# Altium schematic sheet MCU.SchDoc: =ProjectName
size A4; CheckedBy: DatNB; Author: Ven; CompanyName: Nacentech; Organization: IMET
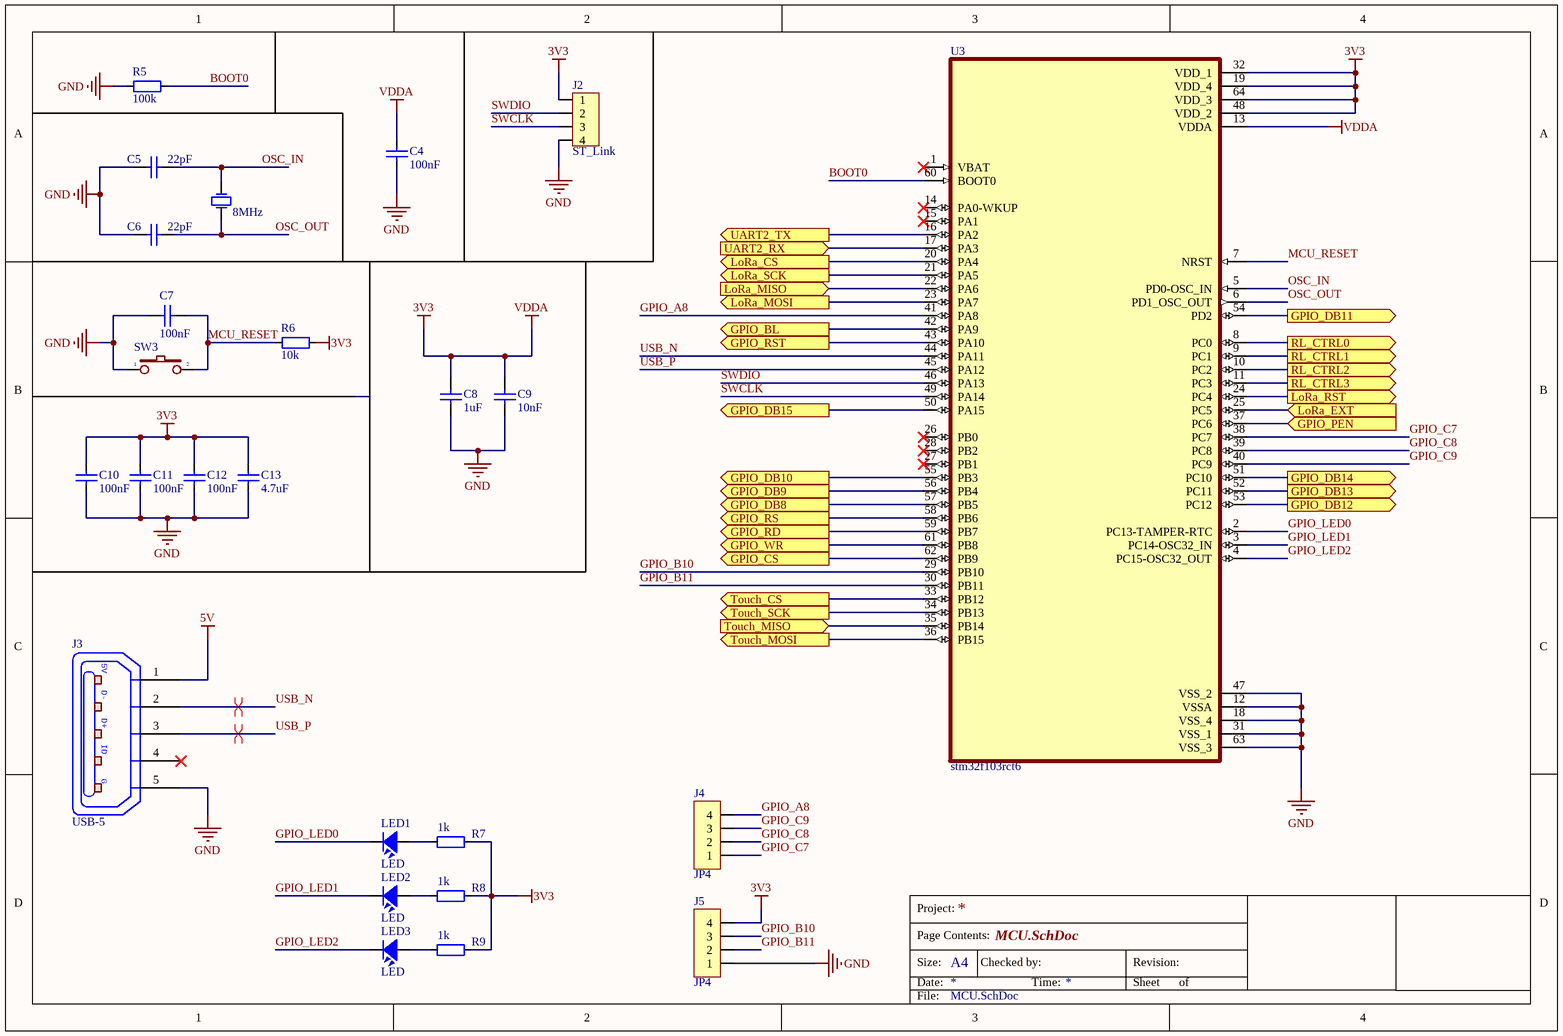
[diagram p0: MCU.SchDoc]

## Parts
C4  100nF  [CAP_0805]
C5  22pF  [CAP_0805]
C6  22pF  [CAP_0805]
C7  100nF  [CAP_0805]
C8  1uF  [CAP_0805]
C9  10nF  [CAP_0805]
C10  100nF  [CAP_0805]
C11  100nF  [CAP_0805]
C12  100nF  [CAP_0805]
C13  4.7uF  [CAP_0805]
J2  ST_Link  [JP4-C1T]
J3  USB-5  [USB-M1]
J4  JP4  [JP4-C1T]
J5  JP4  [JP4-C1T]
LED1  LED  [LED-0805-Red]
LED2  LED  [LED-0805-Green]
LED3  LED  [LED-0805-Blue]
R5  100k  [RES-SMD-0805]
R6  10k  [RES-SMD-0805]
R7  1k  [RES-SMD-0805]
R8  1k  [RES-SMD-0805]
R9  1k  [RES-SMD-0805]
SW3  SW  [SW2]  (value not drawn)
U3  stm32f103rct6  [QFP50P1200X1200X160-64N]
Y1  8MHz  [XTAL]

## Ports
GPIO_BL (out), GPIO_CS (out), GPIO_DB8 (out), GPIO_DB9 (out), GPIO_DB10 (out), GPIO_DB11 (out), GPIO_DB12 (out), GPIO_DB13 (out), GPIO_DB14 (out), GPIO_DB15 (out), GPIO_PEN (in), GPIO_RD (out), GPIO_RS (out), GPIO_RST (out), GPIO_WR (out), LoRa_CS (out), LoRa_EXT (in), LoRa_MISO (in), LoRa_MOSI (out), LoRa_RST (out), LoRa_SCK (out), RL_CTRL0 (out), RL_CTRL1 (out), RL_CTRL2 (out), RL_CTRL3 (out), Touch_CS (out), Touch_MISO (in), Touch_MOSI (out), Touch_SCK (out), UART2_RX (in), UART2_TX (out)

## Nets
3V3: C4.2 C8.2 C9.2 C10.2 C11.2 C12.2 C13.2 J2.1 J5.4 R6.1 R7.1 R8.1 R9.1 U3.13(VDDA) U3.19(VDD_4) U3.32(VDD_1) U3.48(VDD_2) U3.64(VDD_3)  [also labelled VDDA]
5V: J3.1(P1)
GND: C4.1 C5.1 C6.1 C7.1 C8.1 C9.1 C10.1 C11.1 C12.1 C13.1 J2.4 J3.5(P5) J5.1 R5.2 SW3.1 U3.12(VSSA) U3.18(VSS_4) U3.31(VSS_1) U3.47(VSS_2) U3.63(VSS_3)
BOOT0: R5.1 U3.60(BOOT0)
GPIO_A8: J4.4 U3.41(PA8)
GPIO_B10: J5.3 U3.29(PB10)
GPIO_B11: J5.2 U3.30(PB11)
GPIO_BL: U3.42(PA9) ; port GPIO_BL
GPIO_C7: J4.1 U3.38(PC7)
GPIO_C8: J4.2 U3.39(PC8)
GPIO_C9: J4.3 U3.40(PC9)
GPIO_CS: U3.62(PB9) ; port GPIO_CS
GPIO_DB8: U3.57(PB5) ; port GPIO_DB8
GPIO_DB9: U3.56(PB4) ; port GPIO_DB9
GPIO_DB10: U3.55(PB3) ; port GPIO_DB10
GPIO_DB11: U3.54(PD2) ; port GPIO_DB11
GPIO_DB12: U3.53(PC12) ; port GPIO_DB12
GPIO_DB13: U3.52(PC11) ; port GPIO_DB13
GPIO_DB14: U3.51(PC10) ; port GPIO_DB14
GPIO_DB15: U3.50(PA15) ; port GPIO_DB15
GPIO_LED0: LED1.2 U3.2(PC13-TAMPER-RTC)
GPIO_LED1: LED2.2 U3.3(PC14-OSC32_IN)
GPIO_LED2: LED3.2 U3.4(PC15-OSC32_OUT)
GPIO_PEN: U3.37(PC6) ; port GPIO_PEN
GPIO_RD: U3.59(PB7) ; port GPIO_RD
GPIO_RS: U3.58(PB6) ; port GPIO_RS
GPIO_RST: U3.43(PA10) ; port GPIO_RST
GPIO_WR: U3.61(PB8) ; port GPIO_WR
LoRa_CS: U3.20(PA4) ; port LoRa_CS
LoRa_EXT: U3.25(PC5) ; port LoRa_EXT
LoRa_MISO: U3.22(PA6) ; port LoRa_MISO
LoRa_MOSI: U3.23(PA7) ; port LoRa_MOSI
LoRa_RST: U3.24(PC4) ; port LoRa_RST
LoRa_SCK: U3.21(PA5) ; port LoRa_SCK
MCU_RESET: C7.2 R6.2 SW3.2 U3.7(NRST)
OSC_IN: C5.2 U3.5(PD0-OSC_IN) Y1.1(OSC1)
OSC_OUT: C6.2 U3.6(PD1_OSC_OUT) Y1.2(OSC2)
RL_CTRL0: U3.8(PC0) ; port RL_CTRL0
RL_CTRL1: U3.9(PC1) ; port RL_CTRL1
RL_CTRL2: U3.10(PC2) ; port RL_CTRL2
RL_CTRL3: U3.11(PC3) ; port RL_CTRL3
SWCLK: J2.3 U3.49(PA14)
SWDIO: J2.2 U3.46(PA13)
Touch_CS: U3.33(PB12) ; port Touch_CS
Touch_MISO: U3.35(PB14) ; port Touch_MISO
Touch_MOSI: U3.36(PB15) ; port Touch_MOSI
Touch_SCK: U3.34(PB13) ; port Touch_SCK
UART2_RX: U3.17(PA3) ; port UART2_RX
UART2_TX: U3.16(PA2) ; port UART2_TX
USB_N: J3.2(P2) U3.44(PA11)
USB_P: J3.3(P3) U3.45(PA12)
NetLED1_1: LED1.1 R7.2
NetLED2_1: LED2.1 R8.2
NetLED3_1: LED3.1 R9.2

Not connected (* = marked no-connect by the designer): J3 4(P4)*; U3 1(VBAT)* 14(PA0-WKUP)* 15(PA1)* 26(PB0)* 27(PB1)* 28(PB2)*

## Layout directives
differential pair: USB_N, USB_P

## Notes on the sheet
- Project:
- Page Contents:
- Size:
- Date:
- A4
- Checked by:
- Time:
- Revision:
- Sheet
- of
- File:
- (in symbol USB-5) 5V; D-; D+; ID; G

## Library data of the parts
C4-C13 = CapSMD: Capacitor; Value: 33p; Published: 8-Jun-2000; LatestRevisionDate: 17-Jul-2002; LatestRevisionNote: Re-released for DXP Platform.; PackageReference: RAD-0.3; Publisher: Altium Limited
J2 = Header4: Header IDC, 4 x 1 Pin Vertical 2.54mm Pitch (Non-Boxed, Male); Manufacturer: W¨¹rth Elektronik eiSos GmbH; partNo: 613002143121; ComponentLink1 Description: Manufacturer; ComponentLink2 Description: Datasheet; NoPins: 02; Created Date: 29 March 2013; ComponentLink1URL: http://www.we-online.com; ComponentLink2URL: http://katalog.we-online.de/em/datasheet/6130xx143121.pdf; Created by: Karrer Zheng
J3 = USB-5: Manufacturer: FCI; Manufacturer Part Number: 10118193-0001LF; Connector Type: USB - micro B; Number of Contacts: 5; Gender: Receptacle; Specifications: USB 2.0; .Creator: MM; .Checked PCB: RF; Supplier 1: Digi-Key; RoHS: RoHS Compliant; Category: Connectors, Interconnects; Stock 1: 28642; Pricing 1: 1=0.46, 10=0.433, 25=0.3712, 50=0.3156, 100=0.3032, 250=0.27224, 500=0.25988 (USD); Packaging: Cut Tape (CT); Mounting Type: Surface Mount, Right Angle, Horizontal; Features: Shielded, Solder Retention; Ingress Protection: -; ComponentLink1URL: http://portal.fciconnect.com/Comergent//fci/drawing/10118193.pdf; ComponentLink1Description: http://portal.fciconnect.com/Comergent//fci/drawing/10118193.pdf; Supplier Part Number 1: 609-4616-1-ND; .Checked SCH: MM
J4 J5 = JP4: WR-PHD 2.54 mm Angled Socket Header; Manufacturer: W¨¹rth Elektronik eiSos GmbH; partNo: 613004143121; ComponentLink1 Description: Manufacturer; ComponentLink2 Description: Datasheet; NoPins: 04; Created Date: 29 March 2013; ComponentLink1URL: http://www.we-online.com; ComponentLink2URL: http://katalog.we-online.de/em/datasheet/6130xx143121.pdf; Created by: Karrer Zheng
LED1-LED3 = LED: LED Single colour Green and Red; Value: LED 3 ly Single Colour
R5-R9 = Resistor - SMD: Resistor; Manufacturer: Generic Components; Class: Passive; Published: 08/06/2000; Publisher: Altium Hobart Technology Centre
SW3 = SW2: Switch button 2 pin; Value: SW chip 2 pin
Y1 = XTAL: Crystal Oscillator; Published: 8-Jun-2000; LatestRevisionDate: 17-Jul-2002; LatestRevisionNote: Re-released for DXP Platform.; PackageReference: R38; Publisher: Altium Limited